# Altium schematic sheet DFB (ADAPTER).SchDoc
size A
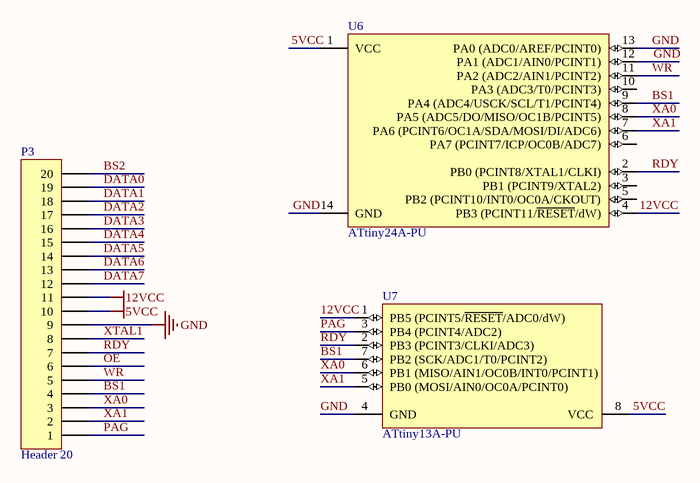
[diagram p0: DFB (ADAPTER).SchDoc]

## Parts
P3  Header 20  [HDR1X20]
U6  ATtiny24A-PU  [14P3]
U7  ATtiny13A-PU  [8P3]

## Nets
5VCC: P3.10 U6.1(VCC) U7.8(VCC)
12VCC: P3.11 U6.4(PB3_(PCINT11/~{RESET}/dW)) U7.1(PB5_(PCINT5/~{RESET}/ADC0/dW))
GND: P3.9 U6.12(PA1_(ADC1/AIN0/PCINT1)) U6.13(PA0_(ADC0/AREF/PCINT0)) U6.14(GND) U7.4(GND)
BS1: P3.4 U6.9(PA4_(ADC4/USCK/SCL/T1/PCINT4)) U7.7(PB2_(SCK/ADC1/T0/PCINT2))
BS2: P3.20
DATA0: P3.19
DATA1: P3.18
DATA2: P3.17
DATA3: P3.16
DATA4: P3.15
DATA5: P3.14
DATA6: P3.13
DATA7: P3.12
OE: P3.6
PAG: P3.1 U7.3(PB4_(PCINT4/ADC2))
RDY: P3.7 U6.2(PB0_(PCINT8/XTAL1/CLKI)) U7.2(PB3_(PCINT3/CLKI/ADC3))
WR: P3.5 U6.11(PA2_(ADC2/AIN1/PCINT2))
XA0: P3.3 U6.8(PA5_(ADC5/DO/MISO/OC1B/PCINT5)) U7.6(PB1_(MISO/AIN1/OC0B/INT0/PCINT1))
XA1: P3.2 U6.7(PA6_(PCINT6/OC1A/SDA/MOSI/DI/ADC6)) U7.5(PB0_(MOSI/AIN0/OC0A/PCINT0))
XTAL1: P3.8

Not connected (* = marked no-connect by the designer): U6 3(PB1_(PCINT9/XTAL2)) 5(PB2_(PCINT10/INT0/OC0A/CKOUT)) 6(PA7_(PCINT7/ICP/OC0B/ADC7)) 10(PA3_(ADC3/T0/PCINT3))

## Library data of the parts
P3 = Header 20: Header, 20-Pin; LatestRevisionDate: 17-Jul-2002; LatestRevisionNote: Re-released for DXP Platform.; Publisher: Altium Limited
U6 = ATtiny24A-PU: 8-bit AVR Microcontroller, 1.8-5.5V, 2KB Flash, 128 Bytes EEPROM, 128 Bytes SRAM, 14-pin PDIP, Industrial Grade (-40°C to 85°C), Pb-Free; Published: 1-Apr-2010; DatasheetVersion: revA, Dec-2008; PackageVersion: revA, Nov-2005; PackageReference: 14P3; Publisher: Altium Limited; PackageDescription: 14-Lead Plastic Dual In-Line, 300 mil/7.62 mm Wide Body (PDIP); Supplier 1: Digi-Key; Supplier Part Number 1: ATTINY24A-PU-ND; Supplier 2: Farnell; Supplier Part Number 2: 1699394; Supplier 3: Mouser; Supplier Part Number 3: 556-ATTINY24A-PU; Code_JEDEC: MS-001-AA; ComponentLink1Description: Manufacturer Link; ComponentLink1URL: http://www.atmel.com/products/avr/default.asp?; ComponentLink2Description: ATtiny24A/44A Datasheet; ComponentLink2URL: http://www.atmel.com/dyn/resources/prod_documents/doc8183.pdf; ComponentLink3Description: ATtiny24A/44A Summary; ComponentLink3URL: http://www.atmel.com/dyn/resources/prod_documents/8183S.pdf; ComponentLink4Description: Atmel.com Home; ComponentLink4URL: http://www.atmel.com
U7 = ATtiny13A-PU: 8-bit AVR Microcontroller, 1.8-5.5V, 1KB Flash, 64 Bytes EEPROM, 64 Bytes SRAM, 8-pin PDIP, Industrial Grade (-40°C to 85°C), Pb-Free; Published: 1-Apr-2010; DatasheetVersion: revD, Nov-2009; PackageVersion: revB, Jan-2002; PackageReference: 8P3; Publisher: Altium Limited; PackageDescription: 8-Lead, 0.300" Wide Body, Plastic Dual In-Line Package (PDIP); Supplier 1: Digi-Key; Supplier Part Number 1: ATTINY13A-PU-ND; Supplier 2: Farnell; Supplier Part Number 2: 1704566; Supplier 3: Mouser; Supplier Part Number 3: 556-ATTINY13A-PU; Code_JEDEC: MS-001-BA; ComponentLink1Description: Manufacturer Link; ComponentLink1URL: http://www.atmel.com/products/avr/default.asp?; ComponentLink2Description: ATtiny13A Datasheet; ComponentLink2URL: http://www.atmel.com/dyn/resources/prod_documents/doc8126.pdf; ComponentLink3Description: ATtiny13A Summary; ComponentLink3URL: http://www.atmel.com/dyn/resources/prod_documents/8126S.pdf; ComponentLink4Description: Atmel.com Home; ComponentLink4URL: http://www.atmel.com